# EAGLE design analog_driver_s (EAGLE 7.4.0)
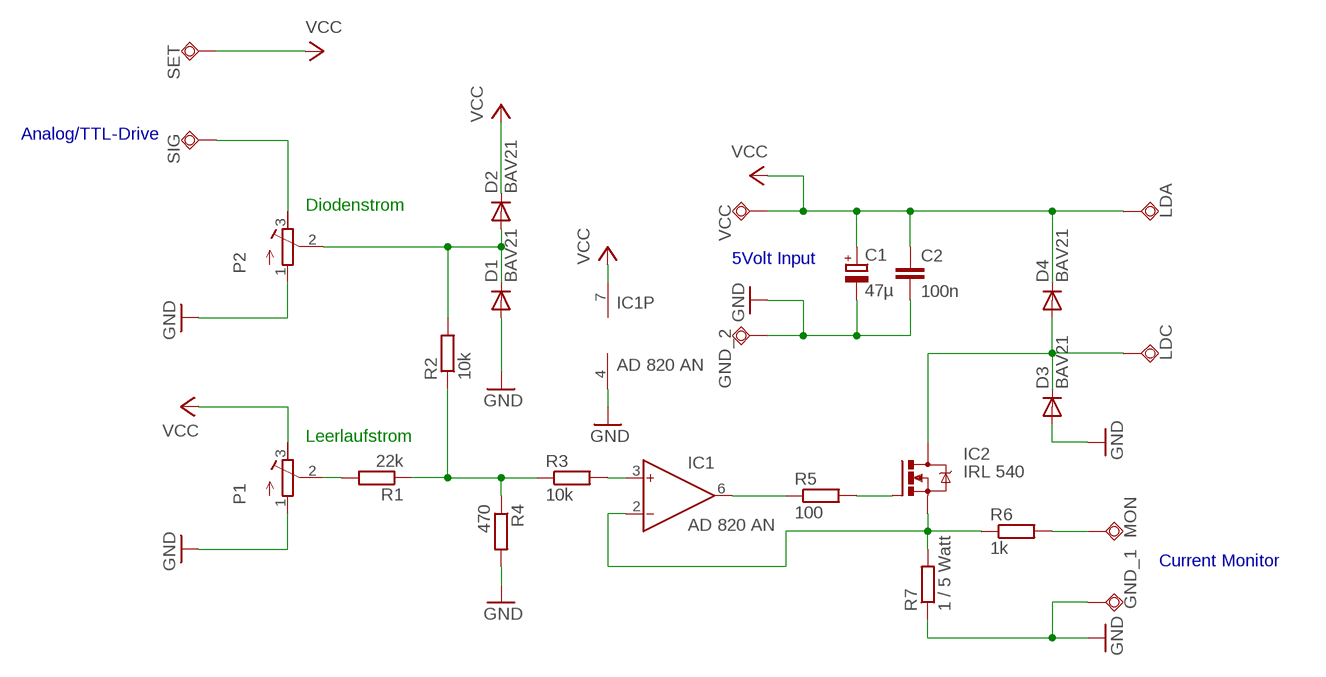
[diagram p0: schematic, sheet 1]

## Parts
C1  47µ  CPOL-EUE2-5  [E2-5]
C2  100n  C-EU025-024X044  [C025-024X044]
D1  BAV21  [DO35-10]
D2  BAV21  [DO35-10]
D3  BAV21  [DO35-10]
D4  BAV21  [DO35-10]
GND_1  PAD  [PAD]
GND_2  PAD  [PAD]
IC1  AD 820 AN  AD811_N  [DIL08]
IC2  IRL 540  IRF540  [TO220BV]
LDA  PAD  [PAD]
LDC  PAD  [PAD]
MON  PAD  [PAD]
P1  R-TRIMM3296W  [RTRIM3296W]
P2  R-TRIMM3296W  [RTRIM3296W]
R1  22k  R-EU_0309/V  [0309V]
R2  10k  R-EU_0309/V  [0309V]
R3  10k  R-EU_0309/10  [0309/10]
R4  470  R-EU_0309/V  [0309V]
R5  100  R-EU_0309/V  [0309V]
R6  1k  R-EU_0309/V  [0309V]
R7  1 / 5 Watt  R-EU_0617/5V  [0617V]
SET  PAD  [PAD]
SIG  PAD  [PAD]
VCC  PAD  [PAD]

## Nets
GND: C1.- C2.2 D1.A D3.A GND_1.P$1(TP) GND_2.P$1(TP) IC1.4(V-) P1.1(E) P2.1(E) R4.2 R7.1
N$1: P2.3(A) SIG.P$1(TP)
N$2: P1.2(S) R1.2
N$3: R1.1 R2.1 R3.1 R4.1
N$4: D1.C D2.A P2.2(S) R2.2
N$8: IC1.3(IN+) R3.2
N$10: IC1.6(OUT) R5.1
N$11: IC1.2(IN-) IC2.S R6.1 R7.2
N$12: IC2.G R5.2
N$13: MON.P$1(TP) R6.2
N$15: D3.C D4.A IC2.D LDC.P$1(TP)
VCC: C1.+ C2.1 D2.C D4.C IC1.7(V+) LDA.P$1(TP) P1.3(A) SET.P$1(TP) VCC.P$1(TP)
Unconnected: IC1.1(NC) IC1.5(NC) IC1.8(NC)

## Notes on the sheet
- Analog/TTL-Drive
- Diodenstrom
- 5Volt Input
- Leerlaufstrom
- Current Monitor

## Library data of the parts
C1 = rcl:CPOL-EU: POLARIZED CAPACITOR, European symbol
C2 = rcl:C-EU: CAPACITOR, European symbol
D1-D4 = diode:BAV21: DIODE high-voltage general purpose diode
GND_1 GND_2 LDA LDC MON SET SIG VCC = div:PAD
IC1 = analog-devices:AD811_N: ANALOG DEVICES
IC2 = transistor-power:IRF540: HEXFET Power MOSFET
P1 P2 = rcl:R-TRIMM: Trimm resistor
R1-R7 = rcl:R-EU_: RESISTOR, European symbol

## Board
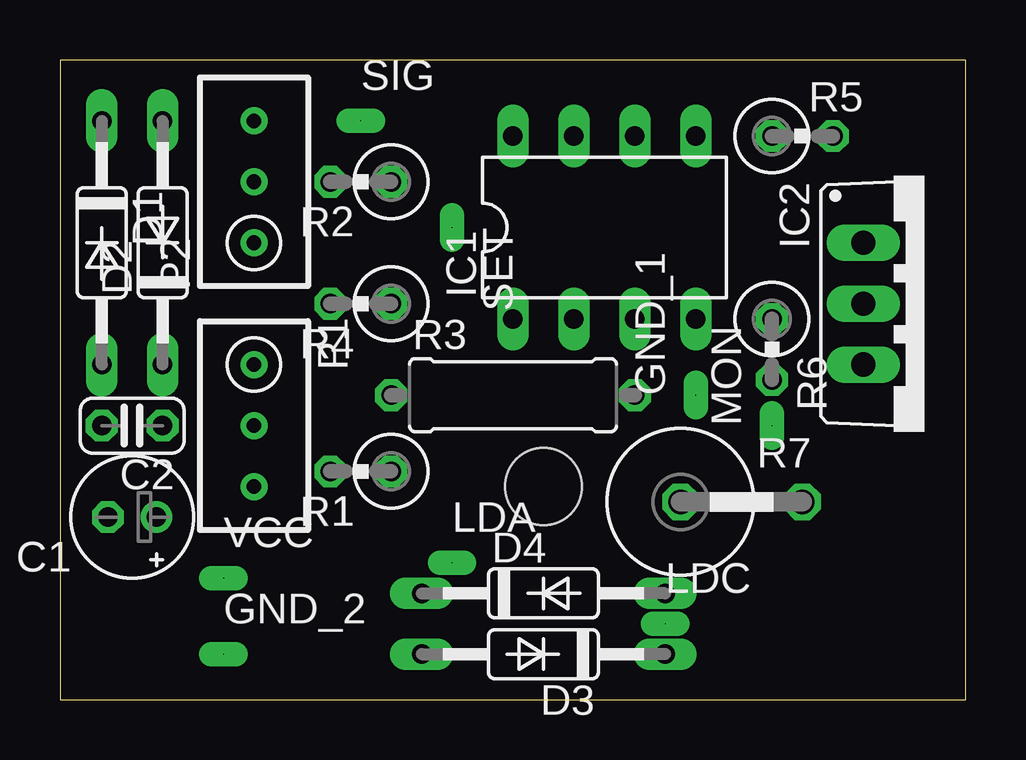
[diagram p1: board, top side]
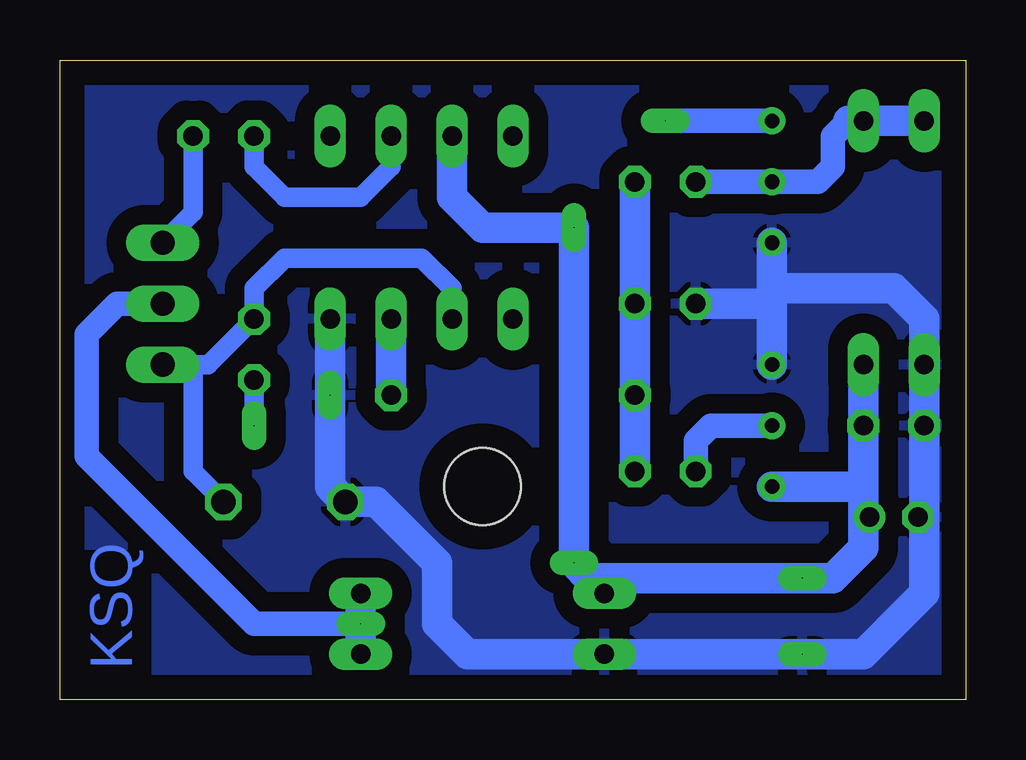
[diagram p2: board, bottom side, seen from below]

Size 37.77 x 26.66 mm. Coordinates in mm from the lower left corner, seen from the top.
Outline: 0,0 37.77,0 37.77,26.66 0,26.66 0,0
Copper layers (1*16): Top 0.035mm / dielectric 1.5mm / Bottom 0.035mm
Design rules "default": minimum track width 10mil, minimum drill 24mil, track to track 8mil, track to pad 8mil, pad to pad 8mil, via to via 8mil, smd to smd 8mil, copper to edge 40mil, drill to drill 8mil, minimum pad ring 10mil, minimum via ring 8mil, stop-mask expansion 4mil, vias tented up to drill 0mil, thermal gap 10mil
Holes 3.2 mm at 20.16,8.88

### Footprints (pad centres in the part's own frame; a part is rotated, then mirrored left to right if it is on the bottom)
E2-5 = drill 0.813 pad 1.27: + -1.016,0 | drill 0.813 pad 1.27 octagon: - 1.016,0
C025-024X044 = drill 0.813 octagon: 1 -1.27,0; 2 1.27,0
DO35-10 = drill 0.813 long: A 5.08,0; C -5.08,0
PAD = drill 0.031 pad 1.016 long: P$1 0,0
DIL08 = drill 0.813 long: 1 -3.81,-3.81; 2 -1.27,-3.81; 3 1.27,-3.81; 4 3.81,-3.81; 5 3.81,3.81; 6 1.27,3.81; 7 -1.27,3.81; 8 -3.81,3.81
TO220BV = drill 1.016 long: D 0,-2.54; G -2.54,-2.54; S 2.54,-2.54
RTRIM3296W = drill 0.61: 1 0,-2.54; 2 0,0; 3 0,2.54
0309V = drill 0.813 octagon: 1 -1.27,0; 2 1.27,0
0309/10 = drill 0.813 octagon: 1 -5.08,0; 2 5.08,0
0617V = drill 1.016 octagon: 1 -2.54,0; 2 2.54,0

### Placement (x,y rotation side)
C1  3.01,7.62 180 top
C2  3.01,11.42 180 top
D1  1.74,19.05 270 top
D2  4.28,19.05 90 top
D3  20.16,1.9 180 top
D4  20.16,4.44 0 top
GND_1  26.5,12.7 90 top
GND_2  6.82,1.9 0 top
IC1  22.7,19.68 0 top
IC2  36.03,16.51 270 top
LDA  16.34,5.71 0 top
LDC  25.23,3.17 0 top
MON  29.68,11.42 90 top
P1  8.09,11.42 180 top
P2  8.09,21.59 0 top
R1  12.54,9.52 180 top
R2  12.54,21.59 180 top
R3  18.88,12.7 0 top
R4  12.54,16.51 180 top
R5  30.95,23.49 0 top
R6  29.68,14.6 270 top
R7  28.41,8.25 0 top
SET  16.34,19.68 270 top
SIG  12.54,24.12 0 top
VCC  6.82,5.08 0 top

### Tracks (layer width: path | path; a pad name or v marks a point on that pad's centre or on a via)
GND
  Bottom 1.27: 8.09,17.14 3.01,17.14 1.74,15.87 D1.A C2.2 1.74,7.62 | 1.74,7.62 C1.- | 1.74,7.62 1.74,4.44 4.28,1.9 GND_2.P$1 D3.A 20.79,1.9 22.06,3.17 22.06,5.71 24.6,8.25 R7.1 26.5,8.88 GND_1.P$1 IC1.4 | 8.09,17.14 P2.1 | 8.09,17.14 8.09,16.51 | 8.09,16.51 P1.1 | 8.09,16.51 R4.2
  pour Bottom (isolate 0.813): -0.8,27.3 38.57,27.3 38.57,-0.64 -0.8,-0.64
N$1
  Bottom 1.016: P2.3 SIG.P$1
N$2
  Bottom 1.016: R1.2 11.27,10.79 10.63,11.42 P1.2
N$3
  Bottom 1.27: R2.1 R4.1 R3.1 R1.1
N$4
  Bottom 1.016: 4.92,24.12 5.55,23.49 5.55,22.22 6.19,21.59 P2.2 R2.2
  Bottom 1.27: D1.C D2.A 4.92,24.12
N$8
  Bottom 1.27: R3.2 IC1.3
N$10
  Bottom 0.813: IC1.6 23.96,22.22 25.23,20.95 28.41,20.95 29.68,22.22 R5.1
N$11
  Bottom 0.813: IC1.2 21.43,17.14 22.7,18.41 28.41,18.41 29.68,17.14 R6.1 31.59,13.97 32.22,13.97 | 32.22,13.97 32.22,9.52 R7.2 | 32.22,13.97 IC2.S
N$12
  Bottom 0.813: R5.2 32.22,20.31 IC2.G
N$13
  Bottom 0.813: MON.P$1 R6.2
N$15
  Bottom 1.016: LDC.P$1 29.68,3.17 36.66,10.15 36.66,15.24 35.4,16.51 IC2.D
  Bottom 1.27: D4.A LDC.P$1 D3.C
VCC
  Bottom 1.27: IC1.7 21.43,20.95 20.16,19.68 SET.P$1 LDA.P$1 15.71,5.08 | 15.71,5.08 VCC.P$1 5.55,5.08 4.28,6.35 4.28,7.62 | 15.71,5.08 D4.C | D2.C C2.1 4.28,8.88 | 4.28,7.62 4.28,8.88 | C1.+ 4.28,7.62 | 4.28,8.88 P1.3

### Text on the board
Bottom: KSQ